# EAGLE design MIDIspositivoMIDI_V2_gerber (EAGLE 6.4)
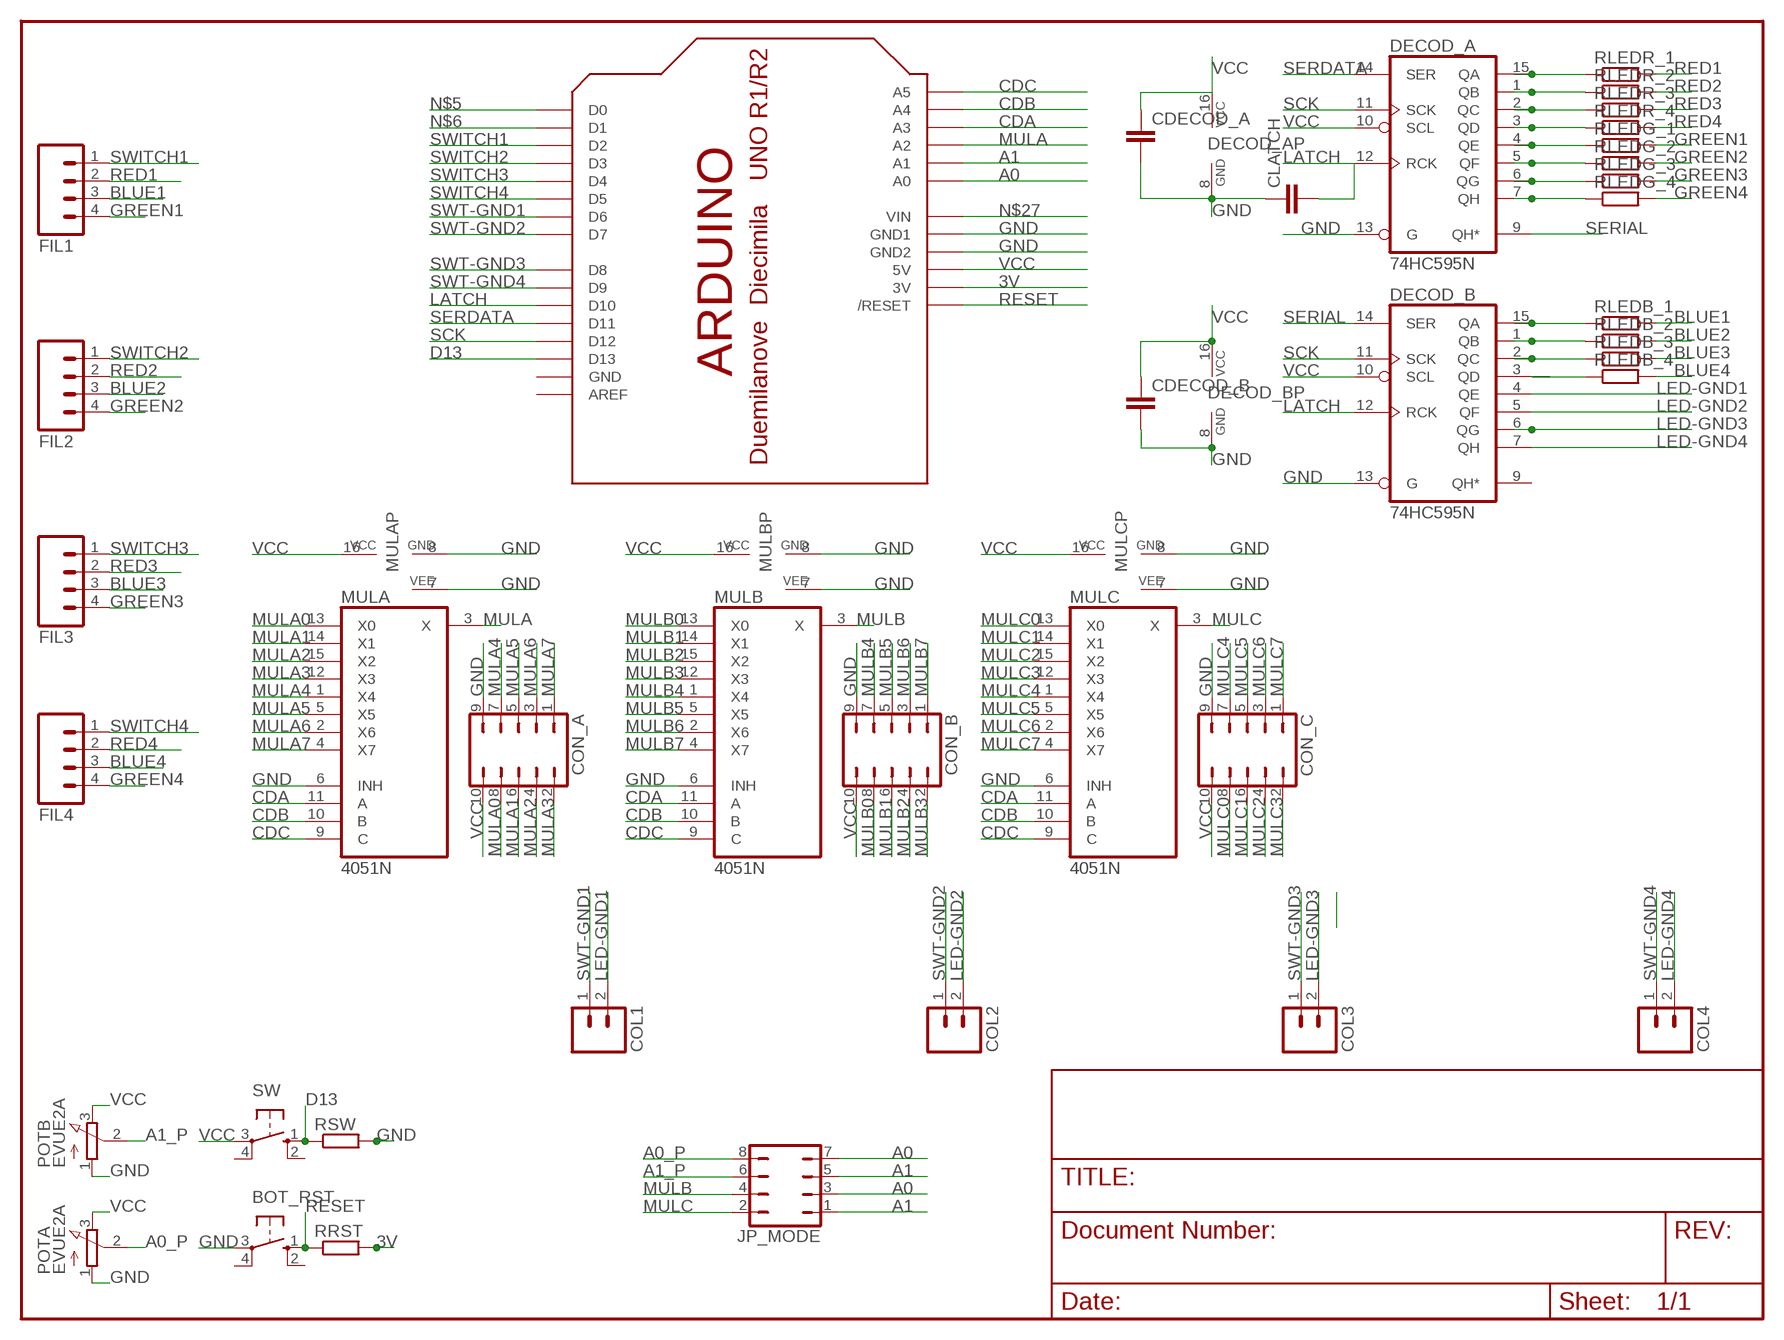
[diagram p0: schematic, sheet 1]

## Parts
BOT_RST  10-XX  [B3F-10XX]
CDECOD_A  C-EU025-030X050  [C025-030X050]
CDECOD_B  C-EU025-030X050  [C025-030X050]
CLATCH  C-EU025-030X050  [C025-030X050]
COL1  M02POLAR  [MOLEX-1X2]
COL2  M02POLAR  [MOLEX-1X2]
COL3  M02POLAR  [MOLEX-1X2]
COL4  M02POLAR  [MOLEX-1X2]
CON_A  JP5Q  [JP5Q]
CON_B  JP5Q  [JP5Q]
CON_C  JP5Q  [JP5Q]
DECOD_A  74HC595N  [DIL16]
DECOD_B  74HC595N  [DIL16]
FIL1  M04POLAR  [MOLEX-1X4]
FIL2  M04POLAR  [MOLEX-1X4]
FIL3  M04POLAR  [MOLEX-1X4]
FIL4  M04POLAR  [MOLEX-1X4]
JP_MODE  JP4Q  [JP4Q]
MULA  4051N  [DIL16]
MULB  4051N  [DIL16]
MULC  4051N  [DIL16]
POTA  EVUE2A  [EVUE]
POTB  EVUE2A  [EVUE]
RLEDB_1  R-EU_0207/10  [0207/10]
RLEDB_2  R-EU_0207/10  [0207/10]
RLEDB_3  R-EU_0207/10  [0207/10]
RLEDB_4  R-EU_0207/10  [0207/10]
RLEDG_1  R-EU_0207/10  [0207/10]
RLEDG_2  R-EU_0207/10  [0207/10]
RLEDG_3  R-EU_0207/10  [0207/10]
RLEDG_4  R-EU_0207/10  [0207/10]
RLEDR_1  R-EU_0207/10  [0207/10]
RLEDR_2  R-EU_0207/10  [0207/10]
RLEDR_3  R-EU_0207/10  [0207/10]
RLEDR_4  R-EU_0207/10  [0207/10]
RRST  R-EU_0207/10  [0207/10]
RSW  R-EU_0207/10  [0207/10]
SW  10-XX  [B3F-10XX]
U$1  ARDUINO-NOHOLE  [ARDUINO-NOHOLE]

## Nets
3V: RRST.2 U$1.3V
A0: JP_MODE.3 JP_MODE.7 U$1.A0
A0_P: JP_MODE.8 POTA.2(S)
A1: JP_MODE.1 JP_MODE.5 U$1.A1
A1_P: JP_MODE.6 POTB.2(S)
BLUE1 [LEDPower]: FIL1.3 RLEDB_1.2
BLUE2 [LEDPower]: FIL2.3 RLEDB_2.2
BLUE3 [LEDPower]: FIL3.3 RLEDB_3.2
BLUE4 [LEDPower]: FIL4.3 RLEDB_4.2
CDA [ButtonSignal]: MULA.11(A) MULB.11(A) MULC.11(A) U$1.A3
CDB: MULA.10(B) MULB.10(B) MULC.10(B) U$1.A4
CDC: MULA.9(C) MULB.9(C) MULC.9(C) U$1.A5
D13: RSW.1 SW.1(S) U$1.D13
GND: BOT_RST.3(P) CDECOD_A.2 CDECOD_B.2 CLATCH.1 CON_A.9 CON_B.9 CON_C.9 DECOD_A.8(GND) DECOD_A.13(G) DECOD_B.8(GND) DECOD_B.13(G) MULA.6(INH) MULA.7(VEE) MULA.8(GND) MULB.6(INH) MULB.7(VEE) MULB.8(GND) MULC.6(INH) MULC.7(VEE) MULC.8(GND) POTA.1(A) POTB.1(A) RSW.2 U$1.GND1 U$1.GND2
GREEN1 [LEDPower]: FIL1.4 RLEDG_1.2
GREEN2 [LEDPower]: FIL2.4 RLEDG_2.2
GREEN3 [LEDPower]: FIL3.4 RLEDG_3.2
GREEN4 [LEDPower]: FIL4.4 RLEDG_4.2
LATCH: CLATCH.2 DECOD_A.12(RCK) DECOD_B.12(RCK) U$1.D10
LED-GND1 [LEDPower]: COL1.2 DECOD_B.4(QE)
LED-GND2 [LEDPower]: COL2.2 DECOD_B.5(QF)
LED-GND3 [LEDPower]: COL3.2 DECOD_B.6(QG)
LED-GND4 [LEDPower]: COL4.2 DECOD_B.7(QH)
MULA [ButtonSignal]: MULA.3(X) U$1.A2
MULA0: CON_A.8 MULA.13(X0)
MULA1: CON_A.6 MULA.14(X1)
MULA2: CON_A.4 MULA.15(X2)
MULA3: CON_A.2 MULA.12(X3)
MULA4: CON_A.7 MULA.1(X4)
MULA5: CON_A.5 MULA.5(X5)
MULA6: CON_A.3 MULA.2(X6)
MULA7: CON_A.1 MULA.4(X7)
MULB: JP_MODE.4 MULB.3(X)
MULB0: CON_B.8 MULB.13(X0)
MULB1: CON_B.6 MULB.14(X1)
MULB2: CON_B.4 MULB.15(X2)
MULB3: CON_B.2 MULB.12(X3)
MULB4: CON_B.7 MULB.1(X4)
MULB5: CON_B.5 MULB.5(X5)
MULB6: CON_B.3 MULB.2(X6)
MULB7: CON_B.1 MULB.4(X7)
MULC: JP_MODE.2 MULC.3(X)
MULC0: CON_C.8 MULC.13(X0)
MULC1: CON_C.6 MULC.14(X1)
MULC2: CON_C.4 MULC.15(X2)
MULC3: CON_C.2 MULC.12(X3)
MULC4: CON_C.7 MULC.1(X4)
MULC5: CON_C.5 MULC.5(X5)
MULC6: CON_C.3 MULC.2(X6)
MULC7: CON_C.1 MULC.4(X7)
N$1: DECOD_A.15(QA) RLEDR_1.1
N$2: DECOD_A.1(QB) RLEDR_2.1
N$3: DECOD_A.2(QC) RLEDR_3.1
N$4: DECOD_A.3(QD) RLEDR_4.1
N$5: U$1.D0
N$6: U$1.D1
N$7: DECOD_A.4(QE) RLEDG_1.1
N$8: DECOD_A.5(QF) RLEDG_2.1
N$9: DECOD_A.6(QG) RLEDG_3.1
N$10: DECOD_A.7(QH) RLEDG_4.1
N$11: DECOD_B.15(QA) RLEDB_1.1
N$27: U$1.VIN
N$28: DECOD_B.1(QB) RLEDB_2.1
N$29: DECOD_B.2(QC) RLEDB_3.1
N$30: DECOD_B.3(QD) RLEDB_4.1
RED1 [LEDPower]: FIL1.2 RLEDR_1.2
RED2 [LEDPower]: FIL2.2 RLEDR_2.2
RED3 [LEDPower]: FIL3.2 RLEDR_3.2
RED4 [LEDPower]: FIL4.2 RLEDR_4.2
RESET: BOT_RST.1(S) RRST.1 U$1.RESET(/RESET)
SCK: DECOD_A.11(SCK) DECOD_B.11(SCK) U$1.D12
SERDATA: DECOD_A.14(SER) U$1.D11
SERIAL: DECOD_A.9(QH*) DECOD_B.14(SER)
SWITCH1 [ButtonSignal]: FIL1.1 U$1.D2
SWITCH2 [ButtonSignal]: FIL2.1 U$1.D3
SWITCH3 [ButtonSignal]: FIL3.1 U$1.D4
SWITCH4 [ButtonSignal]: FIL4.1 U$1.D5
SWT-GND1 [LEDPower]: COL1.1 U$1.D6
SWT-GND2 [LEDPower]: COL2.1 U$1.D7
SWT-GND3 [LEDPower]: COL3.1 U$1.D8
SWT-GND4 [LEDPower]: COL4.1 U$1.D9
VCC: CDECOD_A.1 CDECOD_B.1 CON_A.10 CON_B.10 CON_C.10 DECOD_A.10(SCL) DECOD_A.16(VCC) DECOD_B.10(SCL) DECOD_B.16(VCC) MULA.16(VCC) MULB.16(VCC) MULC.16(VCC) POTA.3(E) POTB.3(E) SW.3(P) U$1.5V
Unconnected: BOT_RST.2(S1) BOT_RST.4(P1) DECOD_B.9(QH*) SW.2(S1) SW.4(P1) U$1.AREF

## Power pins joined to a net without a drawn wire
GND: U$1.GND

## Library data of the parts
BOT_RST SW = switch-omron:10-XX: OMRON SWITCH; MPN: B3F-1000; OC_FARNELL: 176432; OC_NEWARK: 36M3542
CDECOD_A CDECOD_B CLATCH = resistor:C-EU: CAPACITOR, European symbol
COL1-COL4 = SparkFun:M02: Header 2 Standard 2-pin 0.1" header. Use with straight break away headers (SKU : PRT-00116), right angle break away headers (PRT-00553), swiss pins (PRT-00743), machine pins (PRT-00117), and female headers (PRT-00115). Molex polarized connector foot print use with SKU : PRT-08233 with associated crimp pins and housings.
CON_A CON_B CON_C = jumper:JP5Q: JUMPER
DECOD_A DECOD_B = 74xx-eu:74*595: 8-bit SHIFT REGISTER, output latch
FIL1-FIL4 = SparkFun:M04: Header 4 Standard 4-pin 0.1" header. Use with straight break away headers (SKU : PRT-00116), right angle break away headers (PRT-00553), swiss pins (PRT-00743), machine pins (PRT-00117), and female headers (PRT-00115). Molex polarized connector foot print use with SKU : PRT-08231 with associated crimp pins and housings.
JP_MODE = jumper:JP4Q: JUMPER
MULA MULB MULC = 40xx:4051: 8-channel ANALOG MULTIPLEXER
POTA POTB = pot:EVU: 9 mm Square Rotary Potentiometers Source: Panasonic
RLEDB_1-RLEDB_4 RLEDG_1-RLEDG_4 RLEDR_1-RLEDR_4 RRST RSW = resistor:R-EU_: RESISTOR, European symbol
U$1 = adafruit:ARDUINO: Arduino Diecimila/Duemilanove Make a shield with ease, this package has all the named pins as well as the two mounting drill holes and an outline of the USB and DC power connector. The outline is on the DIMENSION layer, so if your board house uses it they will cut the outline to match. http://www.ladyada.net/library/pcb/eaglelibrary.html

## Net classes
0 Default: width 0.254 mm
1 Power: width 0.305 mm
2 LEDPower: width 0.305 mm
3 ButtonSignal: width 0.254 mm

## Board
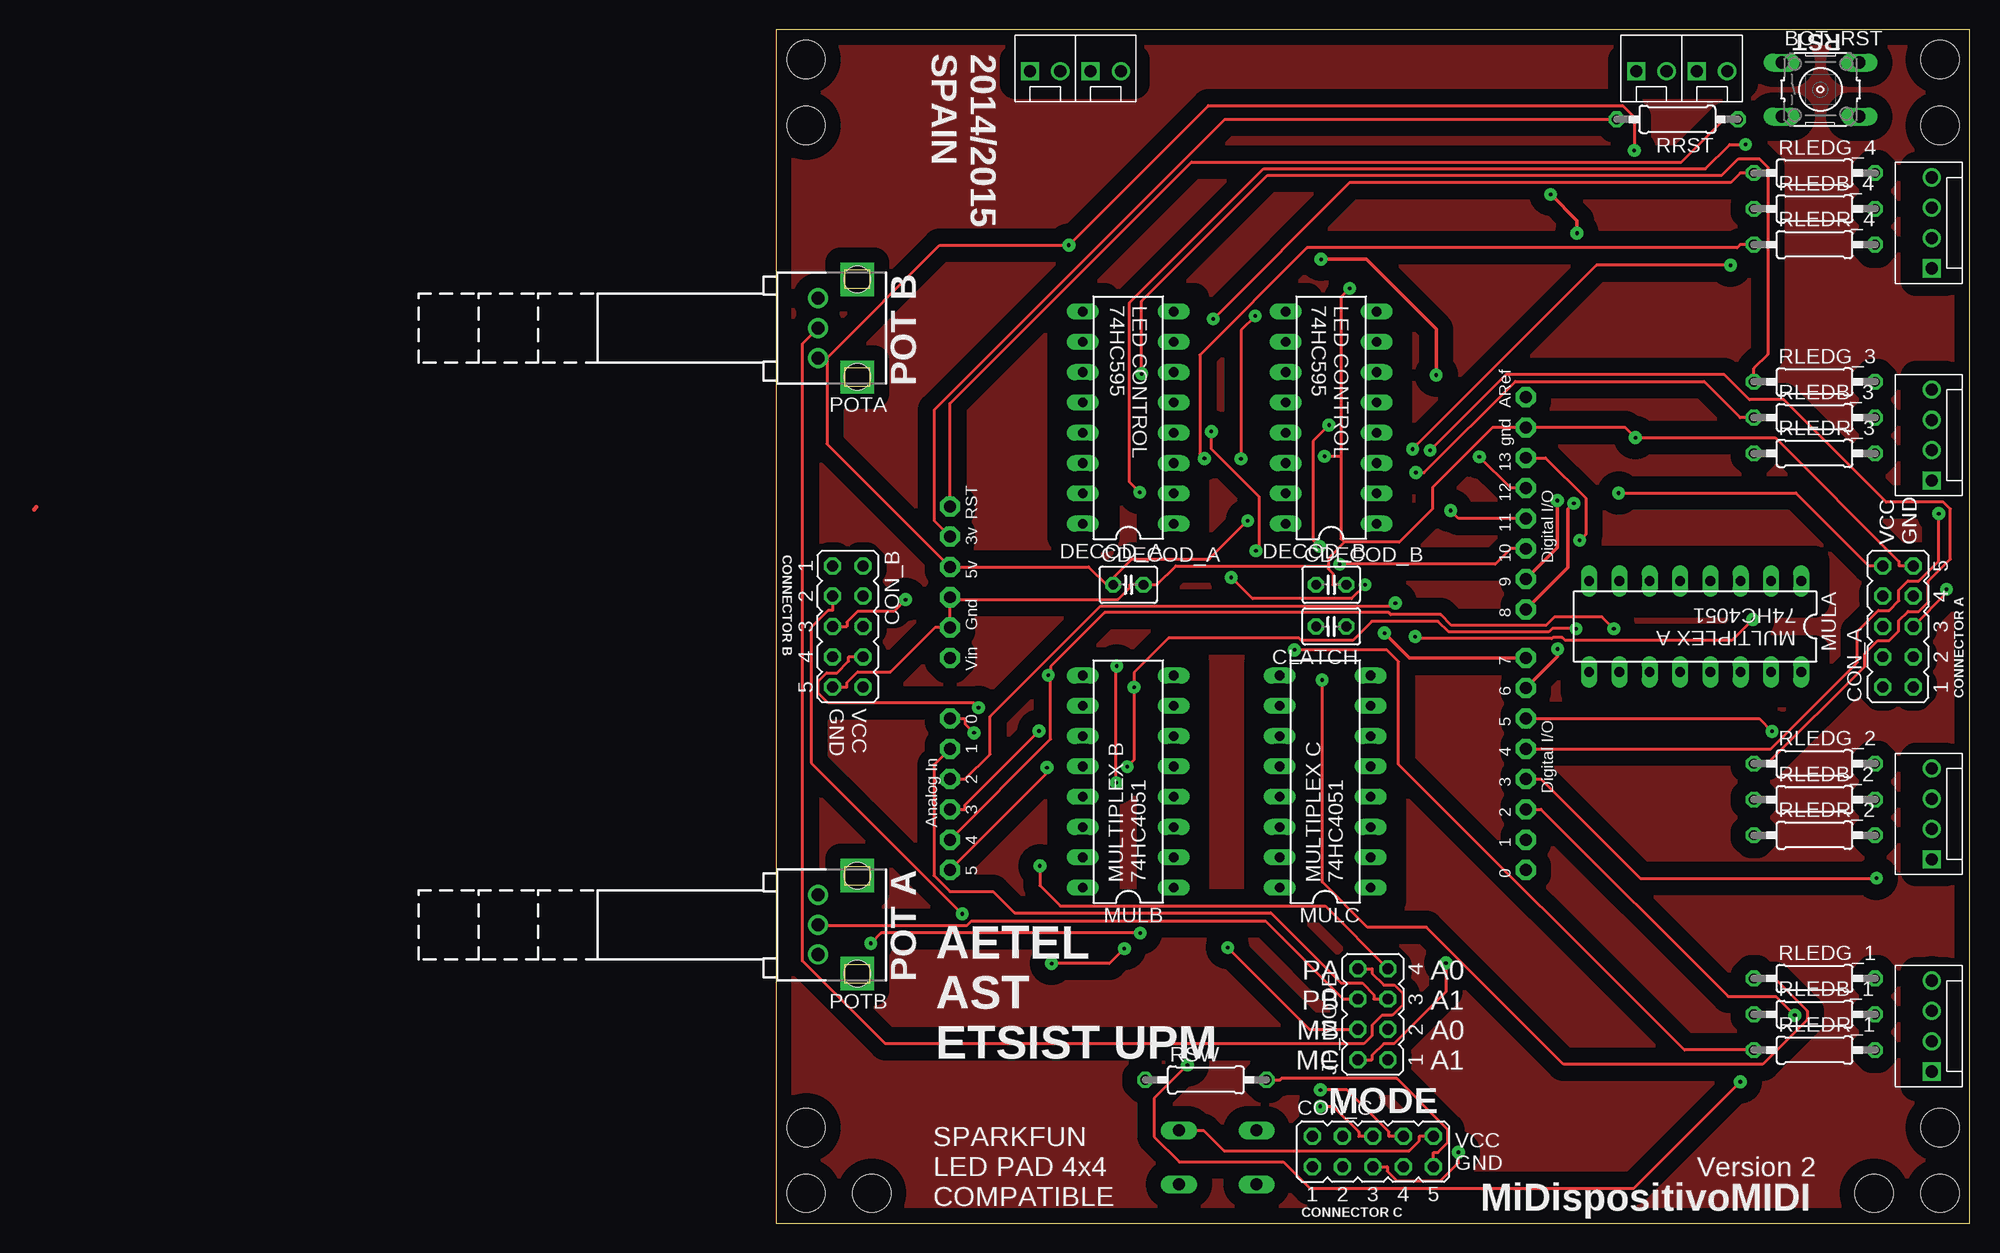
[diagram p1: board, top side]
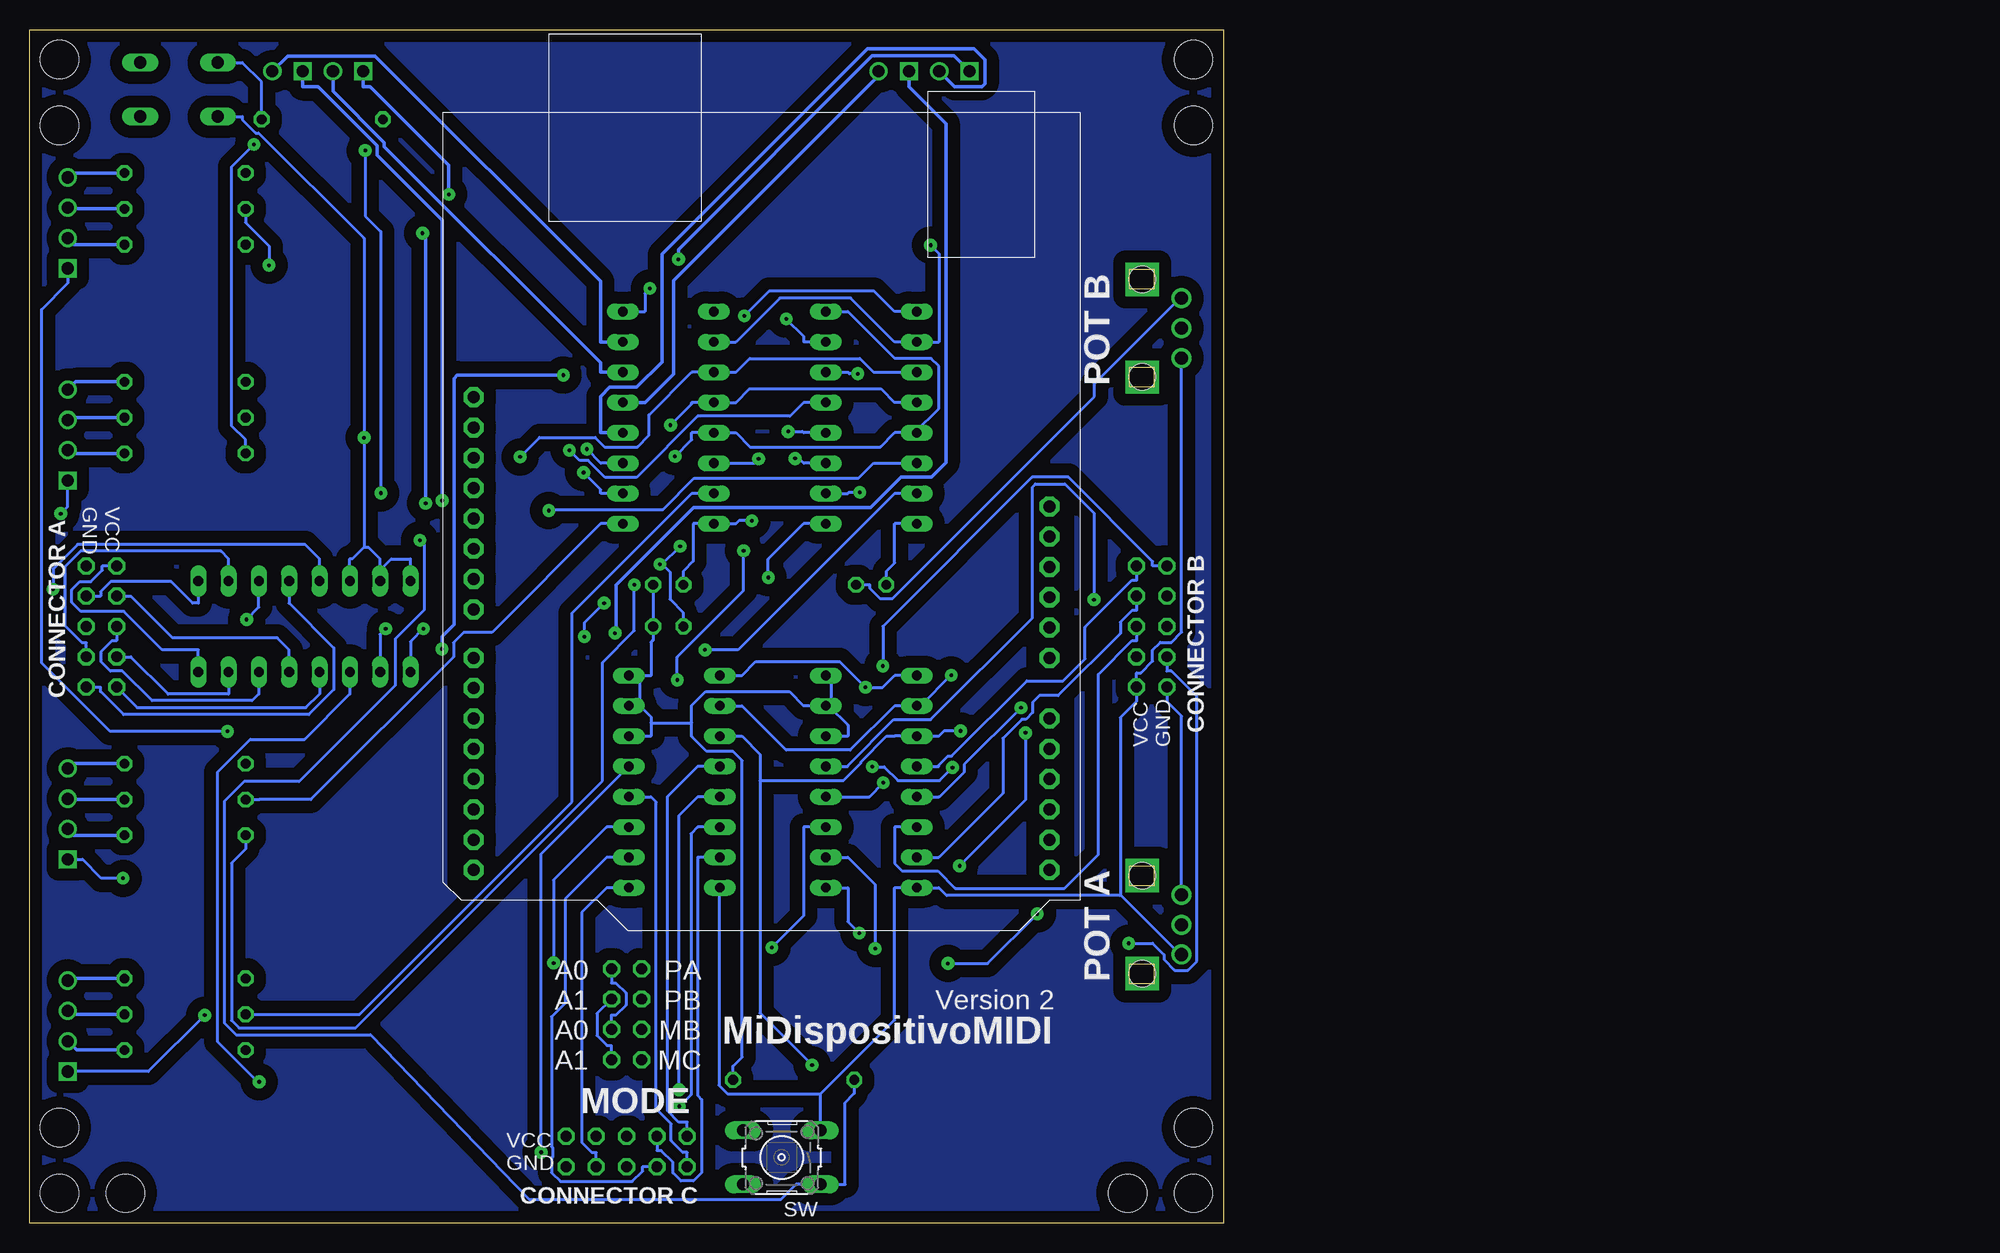
[diagram p2: board, bottom side, seen from below]

Size 100 x 100 mm. Coordinates in mm from the lower left corner, seen from the top.
Outline: 0,0 100,0 100,100 0,100 0,0
Copper layers (1*16): Top 0.035mm / dielectric 1.5mm / Bottom 0.035mm
Design rules "Elecrow_2-layer_eagle_rule": minimum track width 6mil, minimum drill 12mil, track to track 6mil, track to pad 6mil, pad to pad 6mil, via to via 6mil, smd to smd 0mil, copper to edge 10mil, drill to drill 10mil, minimum pad ring 10mil, minimum via ring 6mil, stop-mask expansion 2mil, vias tented up to drill 100mil, thermal gap 10mil
Holes 3.2 mm at 2.5,97.5 2.5,2.5 97.5,2.5 97.5,97.5 8,2.5 92,2.5 2.5,8 97.5,8 2.5,92 97.5,92
Holes 2.2 mm at 6.8,79.1 6.8,70.9 6.8,29.1 6.8,20.9
tRestrict: area 95.9,61.4 to 97.7,63.1; area 95.9,29.7 to 97.6,31.4; area 96,11.8 to 97.8,13.5; area 20,95.5 to 30,97.5; area 71,95.5 to 81,97.5; area 95.5,79 to 98,88.5; area 95.5,61 to 98,71; area 95.5,29.5 to 98,39; area 95.5,11.5 to 98,21; area 24,27 to 27.5,47; area 31.5,27 to 35,47; area 40.5,27 to 44,47; 7 more areas
bRestrict: area 13.5,46 to 15.5,61.5; area 13.5,28.5 to 15.5,43.5; area 62,50 to 64,70.5; area 62,28.5 to 64,48.5

### Footprints (pad centres in the part's own frame; a part is rotated, then mirrored left to right if it is on the bottom)
B3F-10XX = drill 1.016 long: 1 -3.251,2.261; 2 3.251,2.261; 3 -3.251,-2.261; 4 3.251,-2.261
C025-030X050 = drill 0.813 octagon: 1 -1.27,0; 2 1.27,0
MOLEX-1X2 = drill 1.016 square: 1 0,0 | drill 1.016: 2 2.54,0
JP5Q = drill 0.914 octagon: 1 -5.08,-1.27; 2 -5.08,1.27; 3 -2.54,-1.27; 4 -2.54,1.27; 5 0,-1.27; 6 0,1.27; 7 2.54,-1.27; 8 2.54,1.27; 9 5.08,-1.27; 10 5.08,1.27
DIL16 = drill 0.813 long: 1 -8.89,-3.81; 2 -6.35,-3.81; 3 -3.81,-3.81; 4 -1.27,-3.81; 5 1.27,-3.81; 6 3.81,-3.81; 7 6.35,-3.81; 8 8.89,-3.81; 9 8.89,3.81; 10 6.35,3.81; 11 3.81,3.81; 12 1.27,3.81; 13 -1.27,3.81; 14 -3.81,3.81; 15 -6.35,3.81; 16 -8.89,3.81
MOLEX-1X4 = drill 1.016 square: 1 0,0 | drill 1.016: 2 2.54,0; 3 5.08,0; 4 7.62,0
JP4Q = drill 0.914 octagon: 1 -3.81,-1.27; 2 -3.81,1.27; 3 -1.27,-1.27; 4 -1.27,1.27; 5 1.27,-1.27; 6 1.27,1.27; 7 3.81,-1.27; 8 3.81,1.27
EVUE = drill 1.1 pad 1.676: 1 0,-2.5; 2 0,0; 3 0,2.5 | drill 1.6 pad 2.8 square: M1 -3.3,4.1; M2 -3.3,-4.1
0207/10 = drill 0.813 octagon: 1 -5.08,0; 2 5.08,0
ARDUINO-NOHOLE = drill 1 pad 1.676 octagon: 3V 35.56,2.54; 5V 38.1,2.54; A0 50.8,2.54; A1 53.34,2.54; A2 55.88,2.54; A3 58.42,2.54; A4 60.96,2.54; A5 63.5,2.54; AREF 23.876,50.8; D0 63.5,50.8; D1 60.96,50.8; D2 58.42,50.8; D3 55.88,50.8; D4 53.34,50.8; D5 50.8,50.8; D6 48.26,50.8; D7 45.72,50.8; D8 41.656,50.8; D9 39.116,50.8; D10 36.576,50.8; D11 34.036,50.8; D12 31.496,50.8; D13 28.956,50.8; GND 26.416,50.8; GND1 43.18,2.54; GND2 40.64,2.54; RESET 33.02,2.54; VIN 45.72,2.54

### Placement (x,y rotation side)
BOT_RST  87.5,95 0 top
CDECOD_A  29.5,53.5 0 top
CDECOD_B  46.5,53.5 0 top
CLATCH  46.5,50 180 top
COL1  21.26,96.52 0 top
COL2  26.34,96.52 0 top
COL3  72.06,96.52 0 top
COL4  77.14,96.52 0 top
CON_A  94,50 90 top
CON_B  6,50 270 top
CON_C  50,6 0 top
DECOD_A  29.5,67.5 90 top
DECOD_B  46.5,67.5 90 top
FIL1  96.83,12.7 90 top
FIL2  96.83,30.48 90 top
FIL3  96.83,62.23 90 top
FIL4  96.83,80.01 90 top
JP_MODE  50,17.5 90 top
MULA  77,50 180 top
MULB  29.5,37 90 top
MULC  46,37 90 top
POTA  3.5,75 180 top
POTB  3.5,25 180 top
RLEDB_1  87,17.5 0 top
RLEDB_2  87,35.49 0 top
RLEDB_3  87,67.5 0 top
RLEDB_4  87,85 0 top
RLEDG_1  87,20.5 0 top
RLEDG_2  87,38.5 0 top
RLEDG_3  87,70.5 0 top
RLEDG_4  87,88 0 top
RLEDR_1  87,14.5 0 top
RLEDR_2  87,32.5 0 top
RLEDR_3  87,64.5 0 top
RLEDR_4  87,82 0 top
RRST  75.5,92.5 180 top
RSW  36,12 0 top
SW  37,5.5 180 bottom
U$1  12.02,93.09 270 top

### Tracks (layer width: path | path; a pad name or v marks a point on that pad's centre or on a via)
3V
  Top 0.254: U$1.3V 13.24,58.84 13.24,68.16 37.58,92.5 RRST.2
A0  (via drill 0.3 pad 1.07)
  Top 0.254: U$1.A0 15.83,42.29 15.83,41.83 v16.57,41.08 | v22.09,29.93 22.09,28.28 23.81,26.57 46.01,26.57 JP_MODE.7
  Bottom 0.254: v16.57,41.08 16.57,35.45 v22.09,29.93 | JP_MODE.3 51.27,17.42 50.9,17.42 50.06,18.27 50.06,19.27 50.9,20.12 51.27,20.12 JP_MODE.7
A0_P
  Top 0.254: POTA.2 2.19,73.69 2.19,21.98 9.14,15.02 49.24,15.02 49.92,15.71 49.92,16.59 50.76,17.42 51.63,17.42 52.49,18.29 52.49,19.27 51.8,19.96 50.9,19.96 49.92,20.94 49.92,21.31 JP_MODE.8
A1
  Top 0.254: JP_MODE.5 50.08,18.77 50.08,19.14 49.1,20.12 47.33,20.12 41.44,26.01 19.97,26.01 18.18,27.8 14.55,27.8 13.22,29.13 13.22,38.41 U$1.A1
  Bottom 0.254: JP_MODE.1 51.27,14.88 51.64,14.88 52.48,15.72 52.48,17.56 JP_MODE.5
A1_P
  Top 0.254: POTB.2 3.55,24.95 15.99,24.95 16.35,25.31 40.99,25.31 47.54,18.77 JP_MODE.6
BLUE1
  Bottom 0.305: RLEDB_1.2 96.55,17.5 FIL1.3
BLUE2
  Bottom 0.305: RLEDB_2.2 96.75,35.49 FIL2.3
BLUE3
  Bottom 0.305: RLEDB_3.2 96.64,67.5 FIL3.3
BLUE4
  Bottom 0.305: RLEDB_4.2 96.73,85 FIL4.3
CDA  (via drill 0.3 pad 1.07)
  Top 0.254: v34.46,13.25 31.66,10.45 31.66,7.24 33.77,5.12 42.5,5.12 44.71,2.91 71.85,2.91 v80.78,11.84 | U$1.A3 15.83,34.67 15.83,35.05 v22.02,41.24
  Bottom 0.254: MULA.11 73.19,44.34 76.97,40.55 81.53,40.55 84.26,37.83 84.26,15.17 80.92,11.84 v80.78,11.84 | 38.81,37.09 31.84,37.09 30.37,38.56 30.37,38.64 28.2,40.81 27.54,40.81 MULB.11 23.84,40.81 23.41,41.24 v22.02,41.24 | 38.81,37.09 38.81,39.29 40.34,40.81 MULC.11 | 38.81,37.09 38.81,17.6 v34.46,13.25
CDB  (via drill 0.3 pad 1.07)
  Top 0.254: v70.19,49.8 69.18,50.81 65.22,50.81 64.51,50.1 56.58,50.1 55.69,50.99 51.48,50.99 51.32,51.15 27.51,51.15 23,46.64 23,45.92 | 23,45.92 v22.8,45.92 | U$1.A4 23,40.57 23,45.92
  Bottom 0.254: v22.8,45.92 25.36,43.35 MULB.10 27.54,43.35 31.25,39.64 36.62,39.64 40.34,43.35 MULC.10 | v70.19,49.8 70.65,49.34 MULA.10
CDC  (via drill 0.3 pad 1.07)
  Top 0.254: v67.03,49.81 65.01,49.81 64.74,49.54 56.35,49.54 55.45,50.43 49.9,50.43 48.3,48.84 43.99,48.84 43.82,49.01 32.87,49.01 29.98,46.12 v29.98,44.9 29.98,38.82 v29.4,38.24 | U$1.A5 22.68,37.71 v22.68,38.17
  Bottom 0.254: v29.4,38.24 28.41,38.24 27.26,37.08 23.78,37.08 v22.68,38.17 | MULB.9 27.54,45.89 28.53,44.9 v29.98,44.9 32.14,47.06 39.17,47.06 40.34,45.89 MULC.9 | v67.03,49.81 68.11,48.73 MULA.9
D13  (via drill 0.3 pad 1.07)
  Top 0.254: U$1.D13 64.45,64.13 67.82,60.76 67.82,57.72 v67.33,57.23
  Bottom 0.254: v67.33,57.23 66.97,56.87 66.97,51.38 69.38,48.96 69.38,45.06 77.45,36.99 82.04,36.99 83.7,35.34 83.7,16.77 82.73,15.79 71.46,15.79 58.16,1.99 37.05,1.99 35.81,3.24 SW.1 31.69,3.24 31.69,10.09 30.92,10.86 RSW.1
GND  (via drill 0.3 pad 1.07)
  Top 0.254: 46.25,55.07 46.25,54.82 46.63,54.44 46.63,53.5 CDECOD_B.2 | 47.6,57.06 46.25,55.71 46.25,55.07 | 46.25,55.07 33.48,55.07 31.91,53.5 CDECOD_A.2 29.63,53.5 29.63,53.26 28.63,52.27 14.56,52.27 | 47.3,64.25 47.3,57.36 47.6,57.06 | v48.05,78.33 47.3,77.58 47.3,64.25 | 47.3,64.25 v45.94,64.25 | 14.56,52.27 U$1.GND2 | 14.56,52.27 U$1.GND1 13.29,49.91 9.57,46.19 6.82,46.19 5.92,45.29 5.92,44.92 CON_B.9 | CON_A.9 94.08,55.08 94.08,55.45 83.71,65.82 v71.99,65.82 71.14,66.67 U$1.GND 62.25,66.67 61.55,66.67 60.01,66.67 54.99,61.64 54.99,59.84 52.2,57.06 47.6,57.06 | RSW.2 42.22,12 42.35,12.13 51.99,12.13 56.29,7.83 56.29,6.76 55.45,5.92 55.08,5.92 CON_C.9
  Bottom 0.254: DECOD_B.8 48.46,76.39 48.46,77.93 v48.05,78.33 | v45.94,64.25 44.54,65.65 44.54,66.23 DECOD_B.13 40.84,66.23 39.66,65.05 28.72,65.05 27.54,66.23 25.99,66.23 | RSW.2 41.08,13.14 40.31,13.91 40.31,38.76 41.09,39.54 43.29,39.54 44.54,40.78 44.54,41.91 | 44.54,41.91 44.54,43.39 43.38,44.55 36.36,44.55 35.16,43.35 MULB.7 33.08,43.35 | 47.96,41.91 44.54,41.91 | 47.96,41.91 47.96,40.81 MULC.6 | 48.88,43.35 47.96,42.43 47.96,41.91 | 71.99,56.65 72.98,55.66 73.19,55.66 MULA.6 | 71.99,56.65 v71.99,65.82 71.99,82.53 80.83,91.36 81.06,91.36 82.19,92.49 82.19,92.74 BOT_RST.3 | 71.99,56.65 71.64,56.65 70.65,55.66 70.65,54.74 | MULA.8 68.11,55.66 69.72,55.66 70.65,54.74 | MULA.7 70.65,54.74 | DECOD_A.8 31.46,76.39 27.52,72.45 24.47,72.45 23.84,71.81 23.84,68.26 25.82,66.28 25.95,66.28 | 48.88,43.35 MULC.7 | 48.88,45.89 47.96,45.89 47.96,48.67 47.77,48.86 CLATCH.1 CDECOD_B.2 | MULC.8 48.88,45.89 | 48.88,43.35 48.88,45.89 | CDECOD_A.2 29.63,53.5 29.63,53.21 28.76,52.35 27.71,52.35 10.79,69.27 10.79,70.33 3.63,77.5 POTA.1 | 25.99,66.23 25.95,66.28 | 25.95,66.28 | DECOD_A.13 25.99,66.23 | 33.08,43.35 31.46,41.73 31.46,40.81 MULB.6 | 33.08,43.35 32.85,43.35 32.85,45.89 MULB.8 | CON_B.9 4.73,43.73 3.5,42.5 POTB.1
GREEN1
  Bottom 0.305: RLEDG_1.2 96.64,20.5 FIL1.4
GREEN2
  Bottom 0.305: RLEDG_2.2 96.42,38.5 FIL2.4
GREEN3
  Bottom 0.305: RLEDG_3.2 96.17,70.5 FIL3.4
GREEN4
  Bottom 0.305: RLEDG_4.2 96.45,88 FIL4.4
LATCH  (via drill 0.3 pad 1.07)
  Top 0.254: U$1.D10 61.55,56.51 60.26,55.22 v47.21,55.22 | v46.32,66.87 44.98,65.53 44.98,57.26 v45.52,56.72
  Bottom 0.254: 47.01,55.22 v45.52,56.72 | v47.21,55.22 47.01,55.22 | 47.01,55.22 46.37,54.58 46.37,52.29 45.23,51.14 CLATCH.2 | v46.32,66.87 44.54,68.65 44.54,68.77 DECOD_B.12 40.84,68.77 39.69,69.91 28.69,69.91 27.54,68.77 DECOD_A.12
LED-GND1
  Bottom 0.305: DECOD_B.4 52.19,66.23 52.19,69.28 51.43,70.04 49.16,70.04 47.03,72.17 47.03,81.19 29.79,98.42 20.89,98.42 19.98,97.51 19.98,95.49 20.23,95.24 22.52,95.24 COL1.2
LED-GND2
  Bottom 0.305: COL2.2 28.88,96.14 46.04,78.98 46.04,71.16 48.43,68.77 DECOD_B.5
LED-GND3
  Bottom 0.305: COL3.2 74.6,94.85 70.29,90.55 70.29,90.21 52.19,72.11 52.19,71.31 DECOD_B.6
LED-GND4
  Bottom 0.305: DECOD_B.7 52.19,73.85 52.19,78.93 71.05,97.79 78.41,97.79 COL4.2
MULA  (via drill 0.3 pad 1.07)
  Top 0.254: v81.84,50.58 80.08,48.83 66.11,48.83 65.86,49.07 65.06,49.07 64.97,48.98 53.72,48.98 v53.54,49.15 | v51.88,51.96 51.63,51.71 27.19,51.71 17.91,42.44 17.91,39.29 15.83,37.21 U$1.A2
  Bottom 0.254: v81.84,50.58 80.81,51.61 MULA.3 | v51.88,51.96 53.54,50.29 v53.54,49.15
MULA0
  Bottom 0.254: MULA.13 78.27,48.04 79.27,49.04 88.04,49.04 91.54,52.54 CON_A.8
MULA1
  Bottom 0.254: CON_A.6 92.73,48.81 93.1,48.81 94,47.91 94,47.01 93.26,46.27 92.25,46.27 89.76,43.78 81.37,43.78 80.81,44.34 MULA.14
MULA2
  Bottom 0.254: CON_A.4 91.54,47.46 88.41,44.34 83.35,44.34 MULA.15
MULA3
  Bottom 0.254: CON_A.2 91.01,43.2 76.87,43.2 75.73,44.34 MULA.12
MULA4
  Bottom 0.254: CON_A.7 94.08,52.54 94.08,52.91 93.23,53.75 88.16,53.75 86.36,51.96 85.89,51.96 MULA.1
MULA5  (via drill 0.3 pad 1.07)
  Top 0.254: v98.06,53.11 98.06,52.79 CON_A.5
  Bottom 0.254: MULA.5 75.73,55.66 76.94,56.88 95.99,56.88 98.06,54.81 v98.06,53.11
MULA6
  Bottom 0.254: CON_A.3 95.27,48.65 95.64,48.65 97.09,50.1 97.09,54.97 95.75,56.3 83.99,56.3 83.35,55.66 MULA.2
MULA7
  Bottom 0.254: CON_A.1 94.08,44.92 94.08,44.55 92.14,42.61 76.63,42.61 74.53,44.71 74.53,48.21 78.27,51.96 MULA.4
MULB  (via drill 0.3 pad 1.07)
  Top 0.254: v37.82,23.09 44.68,16.23 JP_MODE.4
  Bottom 0.254: MULB.3 35.16,33.19 35.16,25.75 v37.82,23.09
MULB0  (via drill 0.3 pad 1.07)
  Top 0.254: CON_B.8 6.08,47.46 6.08,47.09 5.1,46.11 4.23,46.11 3.49,45.37 3.49,44.45 4.35,43.59 16.55,43.59 v16.95,43.19
  Bottom 0.254: v16.95,43.19 21.72,38.42 21.72,37.77 23.76,35.73 23.84,35.73 MULB.13
MULB1
  Bottom 0.254: CON_B.6 7.27,48.81 7.64,48.81 10.46,45.99 10.46,30.89 13.29,28.07 22.46,28.07 23.9,29.51 26.9,29.51 27.54,30.15 27.54,33.19 MULB.14
MULB2
  Bottom 0.254: CON_B.4 7.27,51.35 7.64,51.35 8.62,50.37 8.62,49.42 13.84,44.21 15.42,44.21 15.98,43.64 15.98,42.79 16.55,42.22 16.87,42.22 18.48,40.62 18.48,36.01 23.84,30.65 MULB.15
MULB3
  Bottom 0.254: MULB.12 23.84,38.27 23.84,38.39 23.08,39.14 22.75,39.14 16.46,45.44 13.42,45.44 11.58,47.27 11.58,49.95 7.64,53.89 7.27,53.89 CON_B.2
MULB4  (via drill 0.3 pad 1.07)
  Top 0.254: v30.51,24.31 8.8,24.31 v7.93,23.44
  Bottom 0.254: MULB.1 31.46,28.11 31.46,25.26 v30.51,24.31 | CON_B.7 4.73,46.27 4.36,46.27 2.21,44.12 2.21,21.94 2.96,21.19 4.07,21.19 4.97,22.09 4.97,22.48 5.93,23.44 v7.93,23.44
MULB5  (via drill 0.3 pad 1.07)
  Top 0.254: CON_B.5 5.92,50 5.92,50.37 6.82,51.27 9.85,51.27 v10.83,52.25
  Bottom 0.254: v10.83,52.25 10.83,59.49 13.28,61.94 15.75,61.94 16,61.68 16,50.7 24.52,42.19 27.61,42.19 31.46,38.34 31.46,38.27 MULB.5
MULB6  (via drill 0.3 pad 1.07)
  Top 0.254: CON_B.3 4.73,51.35 4.36,51.35 2.93,49.92 2.93,38.57 v15.59,25.91 | v29.17,23.01 27.92,21.76 v23.07,21.76
  Bottom 0.254: MULB.2 31.46,30.65 29.17,28.37 v29.17,23.01 | v23.07,21.76 19.75,21.76 v15.59,25.91
MULB7  (via drill 0.3 pad 1.07)
  Top 0.254: v28.53,46.69 28.44,46.6 28.44,36.95 v28.48,36.91
  Bottom 0.254: v28.53,46.69 28.53,50.01 16.02,62.51 12.98,62.51 5.92,55.45 5.92,55.08 CON_B.1 | MULB.4 29.66,35.73 v28.48,36.91
MULC  (via drill 0.3 pad 1.07)
  Top 0.254: JP_MODE.2 49.92,13.69 49.92,14.06 50.9,15.04 51.77,15.04 56.11,19.38 v56.11,21.8
  Bottom 0.254: MULC.3 51.66,33.19 56.11,28.74 v56.11,21.8
MULC0  (via drill 0.3 pad 1.07)
  Top 0.254: CON_C.8 51.35,7.27 51.35,7.64 47.83,11.16 v45.59,11.16
  Bottom 0.254: MULC.13 44.04,35.73 45.59,34.18 v45.59,11.16
MULC1  (via drill 0.3 pad 1.07)
  Top 0.254: CON_C.6 48.81,7.27 48.81,7.64 46.67,9.78 v45.57,9.78
  Bottom 0.254: MULC.14 44.04,33.19 44.6,32.63 44.6,10.75 v45.57,9.78
MULC2
  Bottom 0.254: CON_C.4 47.46,6.08 47.09,6.08 46.11,5.1 46.11,4.2 45.44,3.53 44.4,3.53 43.7,4.23 43.7,10.34 44.04,10.69 44.04,30.65 MULC.15
MULC3
  Bottom 0.254: CON_C.2 44.92,8.46 45.62,8.46 46.56,9.4 46.56,35.75 44.04,38.27 MULC.12
MULC4
  Bottom 0.254: CON_C.7 52.54,5.92 52.91,5.92 53.75,6.77 53.75,26.02 51.66,28.11 MULC.1
MULC5  (via drill 0.3 pad 1.07)
  Top 0.254: CON_C.5 51.19,4.73 51.19,4.36 52.02,3.53 55.65,3.53 57.16,5.04 v57.16,5.94
  Bottom 0.254: v57.16,5.94 57.16,30.92 MULC.5
MULC6
  Bottom 0.254: MULC.2 51.66,30.65 55.15,27.17 55.15,18.43 56.28,17.29 56.28,6.42 56.2,6.34 56.2,5.54 56.28,5.45 56.28,4.23 55.55,3.49 49.52,3.49 48.65,4.36 48.65,4.73 CON_C.3
MULC7
  Bottom 0.254: CON_C.1 44.92,5.92 45.29,5.92 46.27,6.9 46.27,8.32 47.52,9.57 47.52,35.29 47.96,35.73 MULC.4
N$1  (via drill 0.3 pad 1.07)
  Top 0.254: RLEDR_1.1 76.11,14.5 52.15,38.46 52.15,47.05 51.17,48.04 v43.43,48.04
  Bottom 0.254: v43.43,48.04 40.66,48.04 27.54,61.15 DECOD_A.15
N$2  (via drill 0.3 pad 1.07)
  Top 0.254: v49.35,53.49 49.35,53.46 48.22,52.33 39.91,52.33 v38.13,54.11
  Bottom 0.254: v38.13,54.11 38.13,55.64 35.16,58.61 DECOD_A.1 | RLEDR_2.1 81.92,31.36 83.1,30.18 83.1,16.99 82.46,16.35 72.72,16.35 52.01,37.06 52.01,46.98 49.35,49.64 v49.35,53.49
N$3  (via drill 0.3 pad 1.07)
  Top 0.254: v30.46,61.23 29.61,62.09 29.61,77.14 40.84,88.36 77.87,88.36 79.9,90.39 v81.23,90.39
  Bottom 0.254: RLEDR_3.1 81.92,65.64 83.07,66.79 83.07,88.55 v81.23,90.39 | DECOD_A.2 31.46,61.15 31.37,61.23 v30.46,61.23
N$4  (via drill 0.3 pad 1.07)
  Top 0.254: v35.88,64.08 35.5,64.47 35.5,72.75 44.48,81.74 80.52,81.74 80.78,82 RLEDR_4.1
  Bottom 0.254: DECOD_A.3 35.16,63.69 35.55,64.08 v35.88,64.08
N$7  (via drill 0.3 pad 1.07)
  Top 0.254: RLEDG_1.1 83.66,20.5 86.38,17.78 86.38,17.04 82.66,13.32 65.96,13.32 54.49,24.79 49.55,24.79 45.76,28.59 v45.76,45.51 | v40.2,56.35 40.48,56.63 40.48,60.85 36.46,64.87 v36.46,66.34
  Bottom 0.254: DECOD_A.4 35.16,66.23 35.27,66.34 v36.46,66.34 | v45.76,45.51 45.76,47.43 40.2,52.99 v40.2,56.35
N$8  (via drill 0.3 pad 1.07)
  Top 0.254: RLEDG_2.1 83.06,38.5 91.22,46.66 91.22,47.72 92.31,48.81 93.26,48.81 94.06,49.6 94.06,50.48 94.85,51.27 95.75,51.27 96.54,52.06 96.54,53.81 98.38,55.65 98.38,59.85 97.81,60.42 93,60.42 84.42,69 81.55,69 79.45,71.1 61.12,71.1 v54.8,64.77
  Bottom 0.254: v54.8,64.77 53.93,63.9 53.21,63.9 51.8,62.49 49.17,62.49 44.03,67.63 36.31,67.63 35.16,68.77 DECOD_A.5
N$9  (via drill 0.3 pad 1.07)
  Top 0.254: v30.62,71.18 30.62,77.25 41.17,87.8 79.22,87.8 80.62,89.2 82.38,89.2 83.07,88.51 83.07,72.79 81.92,71.64 RLEDG_3.1
  Bottom 0.254: DECOD_A.6 31.46,71.31 31.33,71.18 v30.62,71.18
N$10  (via drill 0.3 pad 1.07)
  Top 0.254: RLEDG_4.1 80.78,88 79.97,87.19 48.04,87.19 v36.62,75.77
  Bottom 0.254: DECOD_A.7 35.16,73.85 35.16,74.31 v36.62,75.77
N$11
  Bottom 0.254: DECOD_B.15 44.54,61.15 54.58,51.12 54.58,35.3 72.37,17.5 RLEDB_1.1
N$12
  Top 0.381: -62,60 -62.16,59.82
N$13
  pour Bottom (isolate 1.016): 0,100 0,0 100,0 100,100
N$14
  pour Top (isolate 1.27): 0,100 0,0 100,0 100,100
N$28
  Bottom 0.254: RLEDB_2.1 80.78,35.49 76.45,35.49 64.5,47.44 64.5,48.65 63.64,49.51 61.26,49.51 52.16,58.61 DECOD_B.1
N$29  (via drill 0.3 pad 1.07)
  Top 0.254: v53.6,62.89 54.29,62.89 61.91,70.52 77.75,70.52 80.78,67.5 RLEDB_3.1
  Bottom 0.254: DECOD_B.2 52.16,61.15 52.16,61.45 v53.6,62.89
N$30  (via drill 0.3 pad 1.07)
  Top 0.254: v79.95,80.27 68.72,80.27 v53.32,64.87
  Bottom 0.254: RLEDB_4.1 81.92,83.86 79.95,81.89 v79.95,80.27 | DECOD_B.3 52.16,63.69 52.16,63.71 v53.32,64.87
RED1
  Bottom 0.305: RLEDR_1.2 96.08,14.5 FIL1.2
RED2
  Bottom 0.305: RLEDR_2.2 96.31,32.5 FIL2.2
RED3
  Bottom 0.305: RLEDR_3.2 96.56,64.5 FIL3.2
RED4
  Bottom 0.305: RLEDR_4.2 96.28,82 FIL4.2
RESET
  Top 0.254: U$1.RESET 14.56,68.68 34.79,88.92 75.86,88.92 79.44,92.5 RRST.1
  Bottom 0.254: BOT_RST.1 82.19,97.26 80.58,95.65 80.58,93.64 RRST.1
SCK  (via drill 0.3 pad 1.07)
  Top 0.254: U$1.D12 61.55,61.59 v58.93,64.21 v58.92,64.21
  Bottom 0.254: v58.92,64.21 57.3,65.83 52.63,65.83 51.85,65.05 49.09,65.05 48.12,66.02 48.12,67.73 44.54,71.31 43.62,71.31 DECOD_B.11 40.84,71.31 39.69,72.45 30.44,72.45 29.29,71.31 DECOD_A.11
SERDATA  (via drill 0.3 pad 1.07)
  Top 0.254: U$1.D11 57.17,59.05 v56.51,59.71
  Bottom 0.254: v56.51,59.71 56.43,59.8 46.95,59.8 44.33,62.42 30.56,62.42 29.29,63.69 DECOD_A.14
SERIAL  (via drill 0.3 pad 1.07)
  Top 0.254: v40.13,76.03 38.94,74.83 v38.94,64.06
  Bottom 0.254: DECOD_A.9 27.54,76.39 29.25,78.09 38.06,78.09 v40.13,76.03 | DECOD_B.14 39.31,63.69 v38.94,64.06
SWITCH1  (via drill 0.3 pad 1.07)
  Top 0.254: U$1.D2 64.09,34.67 79.76,19 83.76,19 v85.34,17.42
  Bottom 0.254: v85.34,17.42 90.06,12.7 FIL1.1
SWITCH2  (via drill 0.3 pad 1.07)
  Top 0.254: U$1.D3 64.09,37.21 72.39,28.91 v92.19,28.91
  Bottom 0.254: FIL2.1 95.58,30.48 94.01,28.91 v92.19,28.91
SWITCH3  (via drill 0.3 pad 1.07)
  Top 0.254: v97.41,59.45 97.41,55.49 95.73,53.81 94.82,53.81 94.08,53.07 94.08,52.16 93.26,51.35 92.35,51.35 90.58,49.58 90.58,46.98 83.34,39.75 64.09,39.75 U$1.D4
  Bottom 0.254: v97.41,59.45 96.83,60.04 FIL3.1
SWITCH4  (via drill 0.3 pad 1.07)
  Top 0.254: U$1.D5 82.36,42.29 v83.44,41.21
  Bottom 0.254: v83.44,41.21 93.28,41.21 99.02,46.95 99.02,76.57 96.83,78.77 FIL4.1
SWT-GND1  (via drill 0.3 pad 1.07)
  Top 0.305: v55.3,71.07 55.3,74.91 49.44,80.78 v45.65,80.78 | U$1.D6 65.46,47.47 v65.46,48.11
  Bottom 0.305: v45.65,80.78 45.65,81.59 29.42,97.81 22.55,97.81 COL1.1 | v65.46,48.11 65.46,49.15 64.46,50.16 64.46,70.79 64.18,71.07 v55.3,71.07
SWT-GND2  (via drill 0.3 pad 1.07)
  Top 0.305: v50.97,49.45 53.04,47.37 U$1.D7
  Bottom 0.305: v50.97,49.45 50.89,49.52 50.89,53.47 44.38,59.98 29.55,59.98 27.01,62.52 24.44,62.52 23.24,63.72 23.24,92.15 26.34,95.25 COL2.1
SWT-GND3  (via drill 0.3 pad 1.07)
  Top 0.305: v66.83,60.33 66.33,59.83 66.33,54.95 U$1.D8 | v67.09,82.96 67.09,84.02 v64.89,86.22
  Bottom 0.305: COL3.1 72.06,95.25 71.5,95.25 64.89,88.64 v64.89,86.22 | v66.83,60.33 66.83,82.69 v67.09,82.96
SWT-GND4  (via drill 0.3 pad 1.07)
  Top 0.305: U$1.D9 65.45,56.61 v65.45,60.55
  Bottom 0.305: v65.45,60.55 65.45,84.04 70.9,89.49 70.9,90.3 75.86,95.25 77.14,95.25 COL4.1
VCC  (via drill 0.3 pad 1.07)
  Top 0.254: v71.89,89.89 71.89,92.68 70.93,93.64 36.22,93.64 v24.52,81.95 13.7,81.95 4.25,72.5 | CON_A.10 91.54,55.08 85.44,61.18 v70.59,61.18 | CON_C.10 53.89,7.27 53.89,6.9 53.05,6.06 37.5,6.06 35.81,7.76 SW.3 | 4.25,72.5 4.25,65.3 U$1.5V 26.17,54.99 27.66,53.5 | POTA.3 4.25,72.5 | 27.66,53.5 29.79,55.63 36.26,55.63 v39.49,58.86 | CDECOD_A.1 27.66,53.5
  Bottom 0.254: v71.89,89.89 71.89,84.39 70.59,83.09 v70.59,61.18 | 33.75,10.82 27.54,17.03 27.54,28.11 MULB.16 23.84,28.11 23.17,27.45 8.69,27.45 8.63,27.51 | SW.3 33.75,10.82 | MULC.16 42.26,28.04 42.26,11.56 41.52,10.82 33.75,10.82 | 8.63,27.51 3.63,22.5 POTB.3 | 8.63,27.51 8.63,42.36 7.27,43.73 CON_B.10 7.27,45.21 7.27,46.11 6.9,46.11 5.92,47.09 5.92,48.02 5.27,48.67 4.35,48.67 3.5,49.52 POTA.3 | v39.49,58.86 40.58,58.86 40.84,58.61 DECOD_B.16 44.41,58.61 44.41,55.47 45.23,54.64 CDECOD_B.1 | DECOD_B.10 40.84,73.85 37.15,77.54 31.23,77.54 27.54,73.85 DECOD_A.10 23.84,73.85 23.84,81.26 v24.52,81.95 | DECOD_A.16 27.54,58.61 27.54,55.33 28.23,54.64 CDECOD_A.1 | CON_A.10 93.92,55.08 93.92,54.71 94.88,53.75 95.82,53.75 96.48,53.09 96.48,52.02 95.73,51.27 92.11,51.27 88.89,48.04 85.89,48.04 MULA.16

### Text on the board
_tsilk: RST | 2014/2015 / SPAIN | LED CONTROL / 74HC595 | LED CONTROL / 74HC595 | POT B | VCC / GND | VCC / GND | CONNECTOR B | MULTIPLEX A / 74HC4051 | CONNECTOR A | VCC / GND | MULTIPLEX B / 74HC4051 | MULTIPLEX C / 74HC4051 | POT A | AETEL / AST / ETSIST UPM | PA / PB / MB / MC | A0 / A1 / A0 / A1 | MODE | VCC / GND | Version 2 | SPARKFUN / LED PAD 4x4 / COMPATIBLE | MiDispositivoMIDI | CONNECTOR C
_bsilk: POT B | VCC / GND | CONNECTOR B | CONNECTOR A | VCC / GND | POT A | Version 2 | MiDispositivoMIDI | PA / PB / MB / MC | A0 / A1 / A0 / A1 | MODE | VCC / GND | CONNECTOR C